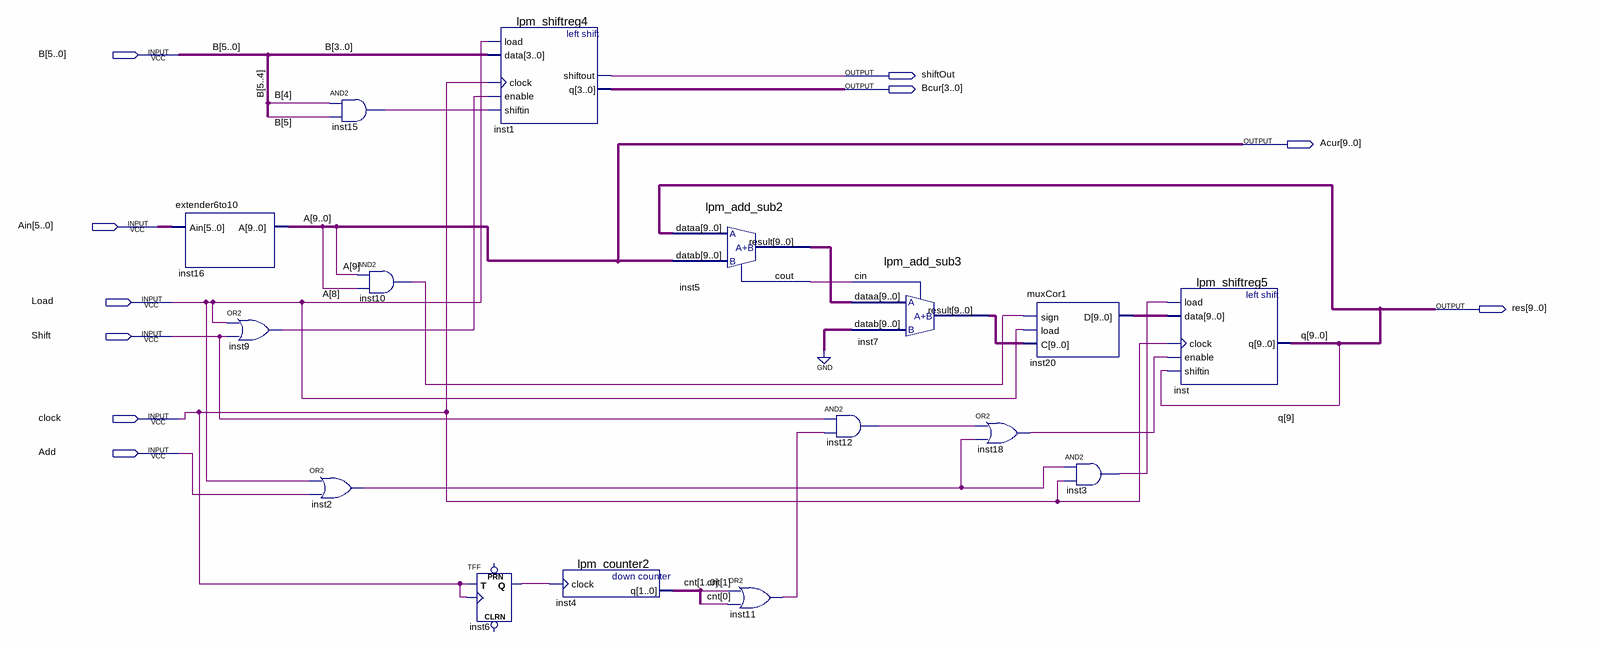
[diagram p0: schematic sheet]
// Quartus schematic Pmain.bdf as structural Verilog: 16 symbols, 10 pins
module Pmain (
  input  [5:0] B,
  input  [5:0] Ain,
  input  Load,
  input  Shift,
  input  clock,
  input  Add,
  output shiftOut,
  output [3:0] Bcur,
  output [9:0] Acur,
  output [9:0] res
);

  wire inst2_out, inst3_out, inst5_cout, inst6_q, inst9_out, inst10_out, inst11_out, inst12_out, inst15_out,
       inst18_out;
  wire [1:0] cnt;
  wire [9:0] inst5_result, inst7_result, inst20_d;

  extender6to10 inst16 (.Ain(Ain), .A(Acur));
  or inst9 (inst9_out, Load, Shift);
  or inst2 (inst2_out, Load, Add);
  and inst15 (inst15_out, B[4], B[5]);
  and inst10 (inst10_out, Acur[9], Acur[8]);
  TFF inst6 (.T(clock), .CLK(clock), .Q(inst6_q));  // open: PRN, CLRN
  lpm_shiftreg4 inst1 (
    .load(Load), .data(B[3:0]), .clock(clock), .enable(inst9_out), .shiftin(inst15_out), .shiftout(shiftOut),
    .q(Bcur));
  lpm_counter2 inst4 (.clock(inst6_q), .q(cnt));
  lpm_add_sub2 inst5 (.dataa(res), .datab(Acur), .result(inst5_result), .cout(inst5_cout));
  or inst11 (inst11_out, cnt[1], cnt[0]);
  lpm_add_sub3 inst7 (.dataa(inst5_result), .datab({10{1'b0}}), .cin(inst5_cout), .result(inst7_result));
  and inst12 (inst12_out, Shift, inst11_out);
  muxCor1 inst20 (.sign(inst10_out), .load(Load), .C(inst7_result), .D(inst20_d));
  or inst18 (inst18_out, inst12_out, inst2_out);
  and inst3 (inst3_out, inst2_out, clock);
  lpm_shiftreg5 inst (.load(inst3_out), .data(inst20_d), .clock(clock), .enable(inst18_out), .shiftin(res[9]), .q(res));

  // Other names for the same wires on the sheet: A[9:0] = Acur; q[9:0] = res
endmodule
